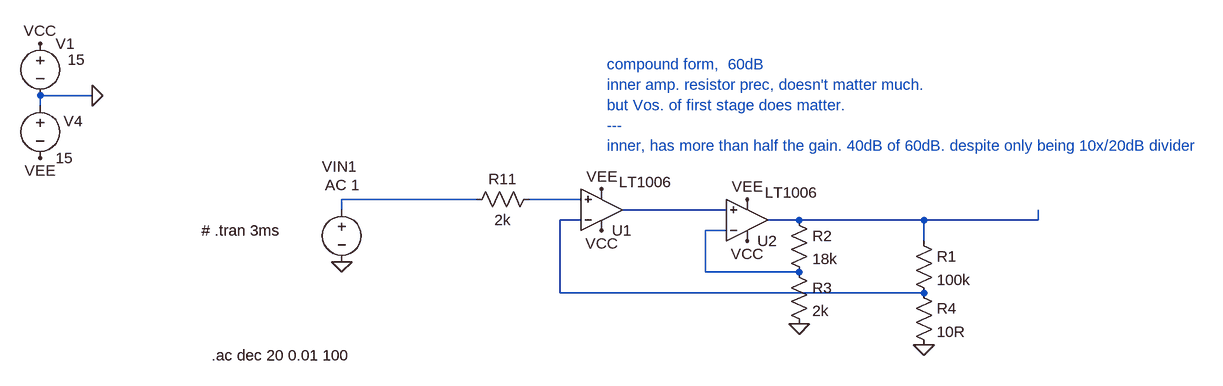
[diagram p0: schematic Draft04.asc]
Draft04.asc, the LTspice schematic file:
Version 4
SHEET 1 2756 2104
WIRE -672 -544 -752 -544
WIRE -752 -528 -752 -544
WIRE -80 -384 -288 -384
WIRE 80 -384 0 -384
WIRE -288 -368 -288 -384
WIRE 304 -368 144 -368
WIRE 80 -352 48 -352
WIRE 416 -352 368 -352
WIRE 608 -352 416 -352
WIRE 784 -352 784 -368
WIRE 784 -352 608 -352
WIRE 304 -336 272 -336
WIRE 608 -320 608 -352
WIRE 272 -272 272 -336
WIRE 416 -272 272 -272
WIRE 48 -240 48 -352
WIRE 608 -240 48 -240
FLAG -752 -624 VCC
FLAG -752 -448 VEE
FLAG 112 -336 VCC
FLAG 112 -400 VEE
FLAG -672 -544 0
FLAG 416 -192 0
FLAG -288 -288 0
FLAG 336 -320 VCC
FLAG 336 -384 VEE
FLAG 608 -160 0
SYMBOL voltage -752 -640 R0
WINDOW 123 0 0 Left 0
WINDOW 39 0 0 Left 0
WINDOW 3 42 41 Left 2
SYMATTR Value 15
SYMATTR InstName V1
SYMBOL voltage -752 -544 R0
WINDOW 123 0 0 Left 0
WINDOW 39 0 0 Left 0
WINDOW 0 36 39 Left 2
SYMATTR InstName V4
SYMATTR Value 15
SYMBOL res -96 -368 R270
WINDOW 0 32 56 VTop 2
WINDOW 3 0 56 VBottom 2
SYMATTR InstName R11
SYMATTR Value 2k
SYMBOL OpAmps\\LT1006 112 -304 M180
WINDOW 3 27 107 Left 2
SYMATTR InstName U1
SYMBOL voltage -288 -384 R0
WINDOW 123 -26 -22 Left 2
WINDOW 39 0 0 Left 0
WINDOW 3 -341 151 Left 2
WINDOW 0 -30 -51 Left 2
SYMATTR Value2 AC 1
SYMATTR Value ""
SYMATTR InstName VIN1
SYMBOL res 400 -368 R0
SYMATTR InstName R2
SYMATTR Value 18k
SYMBOL res 400 -288 R0
SYMATTR InstName R3
SYMATTR Value 2k
SYMBOL OpAmps\\LT1006 336 -288 M180
WINDOW 3 27 107 Left 2
SYMATTR InstName U2
SYMBOL res 592 -336 R0
SYMATTR InstName R1
SYMATTR Value 100k
SYMBOL res 592 -256 R0
SYMATTR InstName R4
SYMATTR Value 10R
TEXT -504 -336 Left 2 !# .tran 3ms
TEXT -488 -144 Left 2 !.ac dec 20 0.01 100
TEXT 120 -592 Left 2 ;compound form,  60dB\ninner amp. resistor prec, doesn't matter much.\nbut Vos. of first stage does matter.\n--- \ninner, has more than half the gain. 40dB of 60dB. despite only being 10x/20dB divider

The netlist it stands for:
* Draft04.asc
V1 VCC 0 15
V4 0 VEE 15
R11 N001 N002 2k
XU1 N002 N004 VCC VEE N003 LT1006  ; pins In+ In- V+ V- OUT
VIN1 N001 0 AC 1
R2 N005 N006 18k
R3 N006 0 2k
XU2 N003 N006 VCC VEE N005 LT1006  ; pins In+ In- V+ V- OUT
R1 N005 N004 100k
R4 N004 0 10R
# .tran 3ms
.ac dec 20 0.01 100
* compound form,  60dB
* inner amp. resistor prec, doesn't matter much.
* but Vos. of first stage does matter.
* ---
* inner, has more than half the gain. 40dB of 60dB. despite only being 10x/20dB divider
.lib LTC.lib
.backanno
.end